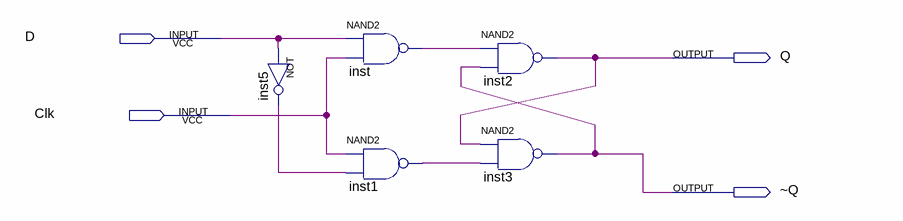
[diagram p0: schematic sheet]
// Quartus schematic lab9step2.bdf as structural Verilog: 5 symbols, 4 pins
module lab9step2 (
  input  D,
  input  Clk,
  output Q,
  output \~Q 
);

  wire inst1_out, inst5_out, inst_out;

  not inst5 (inst5_out, D);
  nand inst (inst_out, D, Clk);
  nand inst1 (inst1_out, Clk, inst5_out);
  nand inst2 (Q, inst_out, \~Q );
  nand inst3 (\~Q , Q, inst1_out);
endmodule
